# Altium schematic sheet BatteryPoweredSchematic.SchDoc
size A4; SheetNumber: 1; SheetTotal: 1
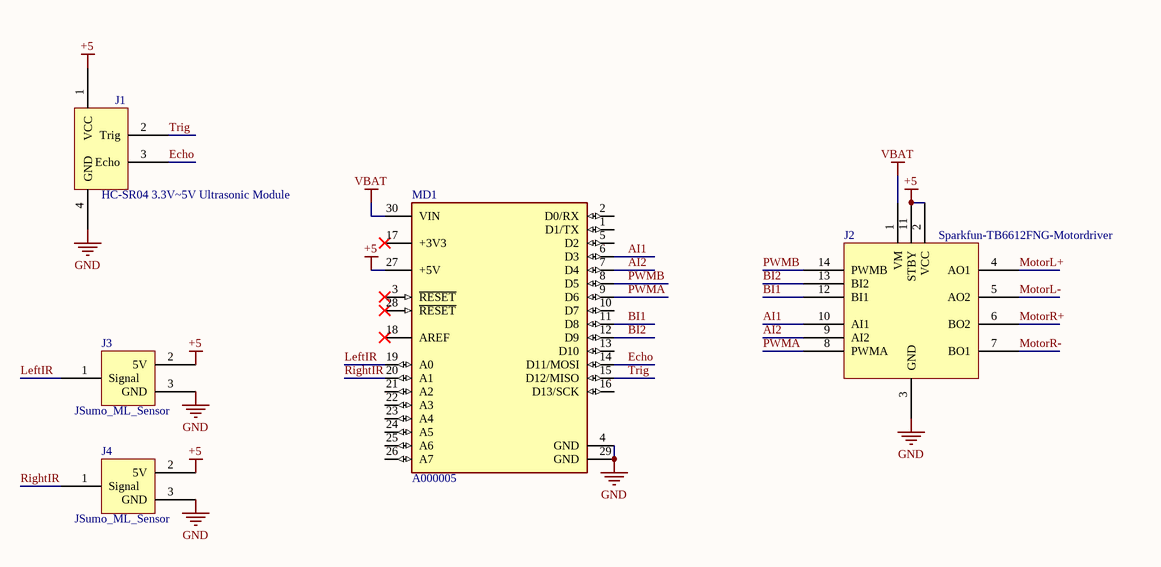
[diagram p0: BatteryPoweredSchematic.SchDoc]

## Parts
J1  HC-SR04 3.3V~5V Ultrasonic Module
J2  Sparkfun-TB6612FNG-Motordriver
J3  JSumo_ML_Sensor
J4  JSumo_ML_Sensor
MD1  A000005  [FP-A000005-MFG]

## Nets
+5: J1.1(VCC) J2.2(VCC) J2.11(STBY) J3.2(5V) J4.2(5V) MD1.27(+5V)
GND: J1.4(GND) J2.3(GND) J3.3(GND) J4.3(GND) MD1.4(GND) MD1.29(GND)
VBAT: J2.1(VM) MD1.30(VIN)
AI1: J2.10(AI1) MD1.6(D3)
AI2: J2.9(AI2) MD1.7(D4)
BI1: J2.12(BI1) MD1.11(D8)
BI2: J2.13(BI2) MD1.12(D9)
Echo: J1.3(Echo) MD1.14(D11/MOSI)
LeftIR: J3.1(Signal) MD1.19(A0)
MotorL+: J2.4(AO1)
MotorL-: J2.5(AO2)
MotorR+: J2.6(BO2)
MotorR-: J2.7(BO1)
PWMA: J2.8(PWMA) MD1.9(D6)
PWMB: J2.14(PWMB) MD1.8(D5)
RightIR: J4.1(Signal) MD1.20(A1)
Trig: J1.2(Trig) MD1.15(D12/MISO)

Not connected (* = marked no-connect by the designer): MD1 1(D1/TX) 2(D0/RX) 3(~{RESET})* 5(D2) 10(D7) 13(D10) 16(D13/SCK) 17(+3V3)* 18(AREF)* 21(A2) 22(A3) 23(A4) 24(A5) 25(A6) 26(A7) 28(~{RESET})*

## Library data of the parts
J1 = CMP-003-000005-1: The HC-SR04 3.3V~5V Ultrasonic Module Distance Measuring Transducer Sensor for Arduino ROHS provides non-contact distance measurement ranging from 2cm to 400cm with an accuracy of up to 2mm
J2 = CMP-003-000003-3: Control up to two DC motor outputs at a constant current of 1.2A. Utilize up to two input signals and four function modes: CW, CCW, short-brake and stop.
J3 J4 = CMP-003-000004-1: Gives clean analog output at black & white surfaces from 2-3mm height from surface. (Can be used at digital inputs)
MD1 = CMP-189986-000002-1: ARDUINO NANO ATMEGA328 EVAL BRD; Number of Bits: 8; Evaluation Kit: Yes; Operating Supply Voltage: 12V; Interface: I2C; Data Bus Width: 8b; Core Architecture: AVR; Packaging: Bulk; Length: 7inch; Package Quantity: 50; Width: 5inch; REACH SVHC: No SVHC; Weight: 0.358383oz; Series: AVR® ATmega; Height: 0.25inch